# EAGLE design sensor_v2 (EAGLE 6.5.0)
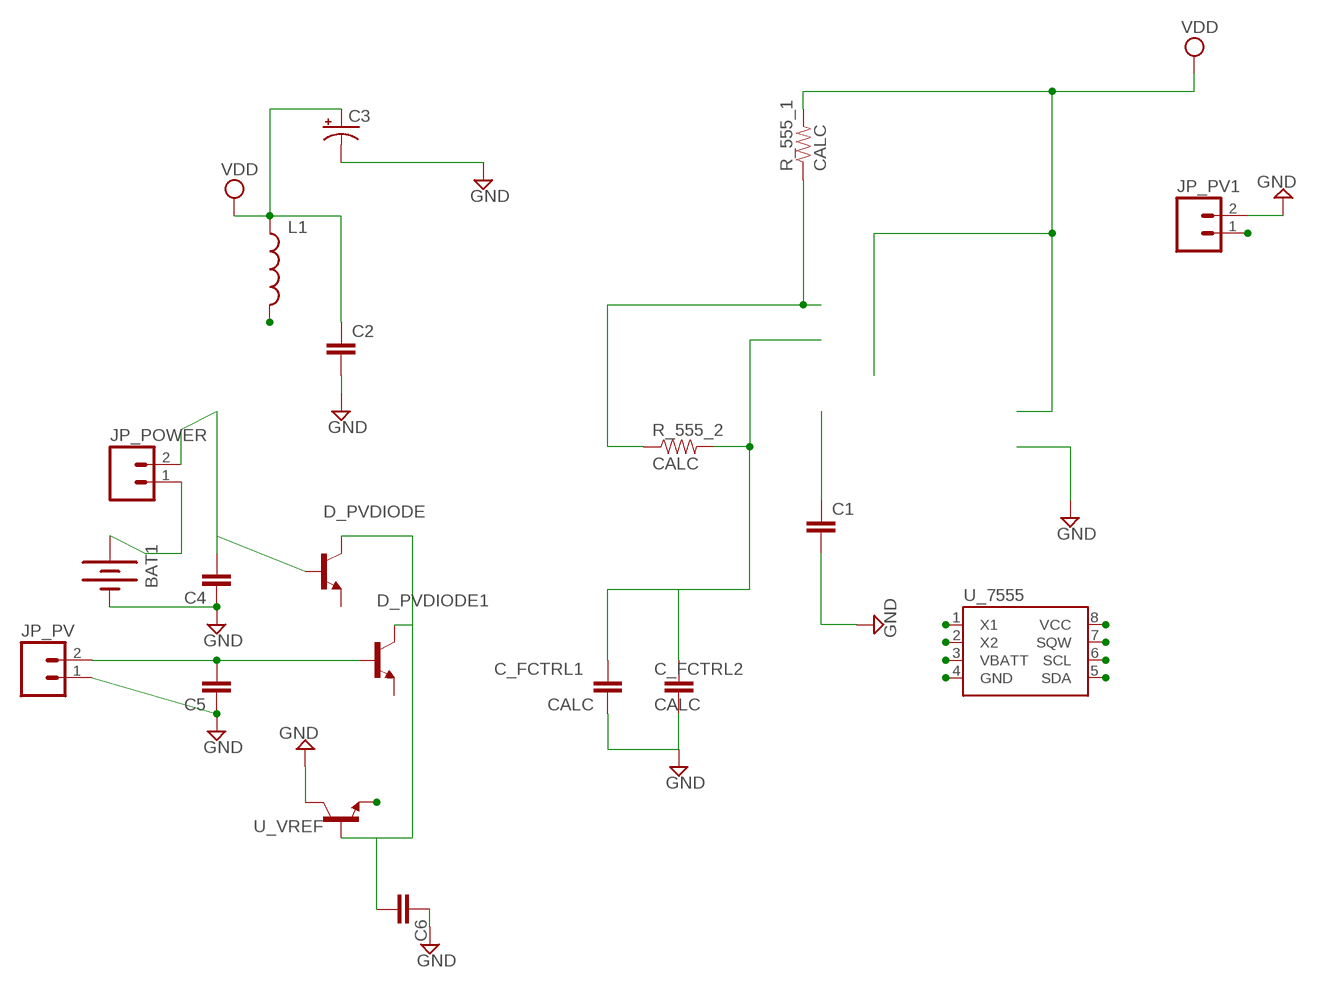
[diagram p0: schematic, sheet 1]

## Parts
BAT1  BATTERY20PTH_LAB  [BATTCOM_20MM_PTH]
C1  CAP0603-CAP  [0603-CAP]
C2  CAP0603-CAP  [0603-CAP]
C3  CAP_POL1206  [EIA3216]
C4  CAP0603-CAP  [0603-CAP]
C5  CAP0603-CAP  [0603-CAP]
C6  CAP0603-CAP  [0603-CAP]
C_FCTRL1  CALC  CAP0603-CAP  [0603-CAP]
C_FCTRL2  CALC  CAP0603-CAP  [0603-CAP]
D_PVDIODE  TRANSISTOR_NPNSOT23-3  [SOT23-3]
D_PVDIODE1  TRANSISTOR_NPNSOT23-3  [SOT23-3]
JP_POWER  M02LOCK  [1X02_LOCK]
JP_PV  M02LOCK  [1X02_LOCK]
JP_PV1  M02LOCK  [1X02_LOCK]
L1  INDUCTOR0603  [0603]
R_555_1  CALC  RESISTOR0805-RES  [0805]
R_555_2  CALC  RESISTOR0603-RES  [0603-RES]
U_7555  DS1307SO8  [SO08]
U_VREF  TRANSISTOR_NPNSOT23-3  [SOT23-3]

## Nets
FOUT: JP_PV1.1 U_7555.3(VBATT)
GND: BAT1.2(-) C1.2 C2.2 C3.C(-) C4.1 C5.1 C6.1 C_FCTRL1.2 C_FCTRL2.2 JP_PV1.2 JP_PV.1 U_7555.1(X1) U_VREF.3(C)
N$3: C5.2 D_PVDIODE1.1(B) JP_PV.2
N$6: BAT1.1(+) JP_POWER.1
N$7: C4.2 D_PVDIODE.1(B) JP_POWER.2
P2: C_FCTRL1.1 C_FCTRL2.1 R_555_2.2 U_7555.2(X2) U_7555.6(SCL)
P5: C1.1 U_7555.5(SDA)
P7: R_555_1.1 R_555_2.1 U_7555.7(SQW)
VDD: C2.1 C3.A(+) L1.1 R_555_1.2 U_7555.4(GND) U_7555.8(VCC)
VREFIN: C6.2 D_PVDIODE1.3(C) D_PVDIODE.3(C) U_VREF.1(B)
VREFOUT: L1.2 U_VREF.2(E)
Unconnected: D_PVDIODE1.2(E) D_PVDIODE.2(E)

## Library data of the parts
BAT1 = semipassiveTag_library:BATTERY: Battery Holders Various common sizes : AA, AAA, 20mm coin cell and 12mm coin cell.
C1 C2 C4-C6 C_FCTRL1 C_FCTRL2 = SparkFun-Capacitors:CAP: Capacitor Standard 0603 ceramic capacitor, and 0.1" leaded capacitor.
C3 = SparkFun-Capacitors:CAP_POL: Capacitor Polarized These are standard SMD and PTH capacitors. Normally 10uF, 47uF, and 100uF in electrolytic and tantalum varieties. Always verify the external diameter of the through hole cap, it varies with capacity, voltage, and manufacturer. The EIA devices should be standard.
D_PVDIODE D_PVDIODE1 U_VREF = SparkFun:TRANSISTOR_NPN: Transistor NPN BJT configuration in SOT23 package. MMBT2222 is the common NPN we use. Double check BCE configuration again layout.
JP_POWER JP_PV JP_PV1 = SparkFun-Connectors:M02: Header 2 Standard 2-pin 0.1" header. Use with straight break away headers (SKU : PRT-00116), right angle break away headers (PRT-00553), swiss pins (PRT-00743), machine pins (PRT-00117), and female headers (PRT-00115). Molex polarized connector foot print use with SKU : PRT-08233 with associated crimp pins and housings.
L1 = SparkFun-Passives:INDUCTOR: Inductors Basic Inductor/Choke - 0603 and 1206. Footprints are not proven and vary greatly between part numbers.
R_555_1 R_555_2 = SparkFun-Resistors:RESISTOR: Resistor Basic schematic elements and footprints for 0603, 1206, and PTH resistors.
U_7555 = SparkFun-FreqCtrl:DS1307: I2C real-time clock with battery backup.

## Board
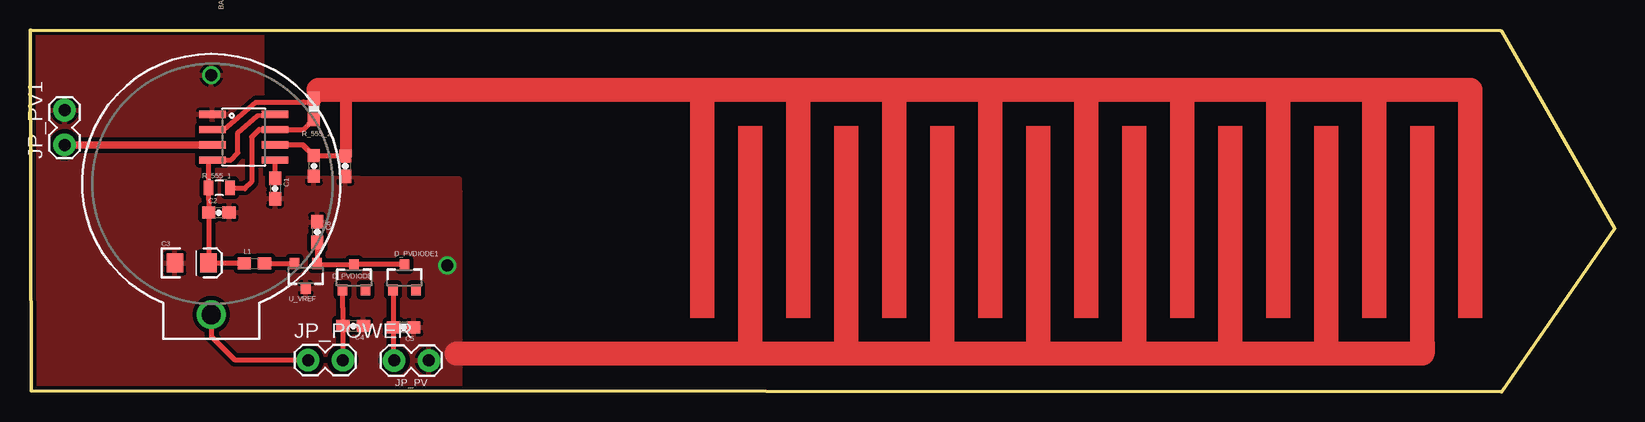
[diagram p1: board, top side]
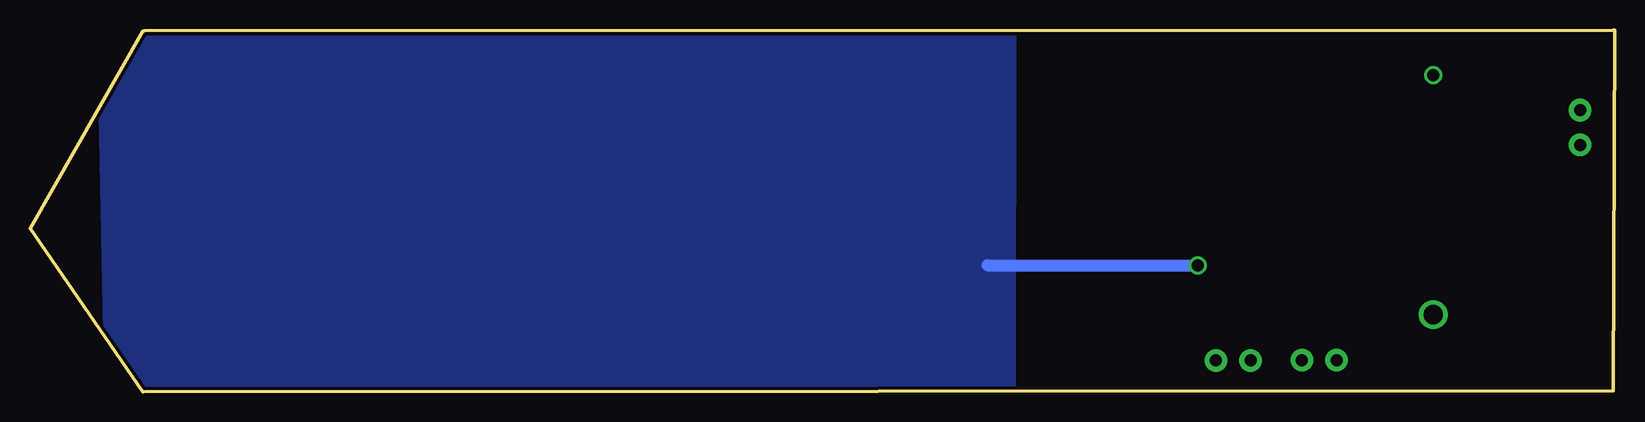
[diagram p2: board, bottom side, seen from below]

Size 132.06 x 30.19 mm. Coordinates in mm from the lower left corner, seen from the top.
Outline: 122.67,30.08 132.06,13.64 122.64,0
Outline: 122.62,0.01 0.12,0.08 0,30.19
Outline: 122.52,30.11 0.12,30.18
Copper layers (1*16): Top 0.035mm / dielectric 1.5mm / Bottom 0.035mm
Design rules "Fusion_eagle_rule_v1.1 *": minimum track width 12mil, minimum drill 12mil, track to track 14mil, track to pad 14mil, pad to pad 14mil, via to via 14mil, smd to smd 0mil, copper to edge 10mil, drill to drill 10mil, minimum pad ring 10mil, minimum via ring 6mil, stop-mask expansion 2mil, vias tented up to drill 100mil, thermal gap 10mil

### Footprints (pad centres in the part's own frame; a part is rotated, then mirrored left to right if it is on the bottom)
BATTCOM_20MM_PTH = drill 1.6: 1 19.99,0 | drill 1: 2 0,0
0603-CAP = smd 1.1 x 1: 1 -0.85,0; 2 0.85,0
EIA3216 = smd 1.4 x 1.6: A 1.4,0; C -1.4,0
SOT23-3 = smd 0.8 x 0.9: 1 -0.95,-1; 2 0.95,-1; 3 0,1.1
1X02_LOCK = drill 1 pad 1.88: 1 -0.178,0; 2 2.718,0
0603 = smd 1.1 x 1: 1 -0.85,0; 2 0.85,0
0805 = smd 0.8 x 1.2: 1 -0.9,0; 2 0.9,0
0603-RES = smd 1.1 x 1: 1 -0.85,0; 2 0.85,0
SO08 = smd 0.61 x 2.21: 1 -1.905,-2.616; 2 -0.635,-2.616; 3 0.635,-2.616; 4 1.905,-2.616; 5 1.905,2.616; 6 0.635,2.616; 7 -0.635,2.616; 8 -1.905,2.616

### Placement (x,y rotation side)
BAT1  15.11,26.42 270 top
C1  20.43,16.96 270 top
C2  15.73,14.94 0 top
C3  13.48,10.74 0 top
C4  26.93,5.48 180 top
C5  31.13,5.37 180 top
C6  23.94,13.34 270 top
C_FCTRL1  23.66,18.85 270 top
C_FCTRL2  26.27,18.82 270 top
D_PVDIODE  27,9.5 0 top
D_PVDIODE1  31.2,9.51 0 top
JP_POWER  23.35,2.65 0 top
JP_PV  33.06,2.62 180 top
JP_PV1  2.88,20.78 90 top
L1  18.7,10.71 0 top
R_555_1  15.77,17.01 180 top
R_555_2  23.66,23.58 90 top
U_7555  17.81,21.24 270 top
U_VREF  22.98,9.72 180 top

### Tracks (layer width: path | path; a pad name or v marks a point on that pad's centre or on a via)
FOUT
  Top 0.61: JP_PV1.1 15.18,20.6 arc45 U_7555.3
GND  (via drill 1)
  Top 2: 47.54,3.18 35.54,3.18
  Bottom 0.406: 52.25,10.56 52.25,10.23
  Bottom 1.016: 52.25,10.56 v34.75,10.56
  pour Top: 5.94,34.6 -3.66,34.78 -3.51,22.98 -3.51,19.51 -3.46,15.71 -3.66,-7.07 35.83,-7.14 35.83,15.88 35.83,17.74 19.22,17.82 19.34,26.12 19.42,34.4
  pour Bottom: 50.04,33.83 126.35,33.53 125.6,-3.11 50.08,-2.72
N$3
  Top 0.406: D_PVDIODE1.1 30.25,5.45 arc45 C5.2 30.28,2.76 arc45 JP_PV.2
N$4
  Top 2: 116.04,4.18 116.04,3.18 44.04,3.18
N$6
  Top 0.406: BAT1.1 15.11,4.61 17.04,2.68 23.13,2.68 JP_POWER.1
N$7
  Top 0.406: D_PVDIODE.1 26.07,6.98 26.07,5.53 | 26.07,5.53 JP_POWER.2 arc-45 JP_POWER.2 | 26.07,5.53 arc45 C4.2
P2
  Top 0.305: 22.75,20.61 22.75,20.48 23.54,19.68 26.34,19.68
  Top 0.406: 15.27,21.85 15.14,21.85 U_7555.2 16.16,21.85 18.85,24.16 23.24,24.16 23.24,24.17 | 22.79,24.17 23.24,24.17 | U_7555.6 22.75,20.61 C_FCTRL1.1 26.27,19.7 C_FCTRL2.1 | 26.29,19.69 C_FCTRL2.1 | 26.34,19.74 C_FCTRL2.1 | 43.54,24.68 43.34,24.88 43.34,25.17 44.03,25.17 44.04,25.18 | R_555_2.2 24.54,24.44 24.54,25.18 | 23.24,24.17 24.04,24.17 24.04,25.18
  Top 1.016: 26.34,19.68 26.34,25.18
  Top 2: 120.04,24.18 120.04,25.18 44.04,25.18 26.34,25.18 24.54,25.18 24.04,25.18
P5
  Top 0.406: C1.1 U_7555.5
P7
  Top 0.406: R_555_2.1 22.81,21.88 U_7555.7 19.09,21.88 18.47,21.26 18.47,17.51 17.91,16.95 16.72,16.95 R_555_1.1
VDD
  Top 0.406: U_7555.8 19.73,23.12 18.94,23.04 17.33,21.64 17.33,19.92 16.75,19.34 U_7555.4 14.87,19.34 R_555_1.2 C2.1 C3.A 17.85,10.74 L1.1
VREFIN
  Top 0.406: C6.2 U_VREF.1 23.98,10.67 arc45 24.16,10.6 D_PVDIODE.3 arc-45 27.03,10.61 D_PVDIODE1.3
VREFOUT
  Top 0.406: L1.2 U_VREF.2
(copper drawn outside any net)
  shapes: Top area x18